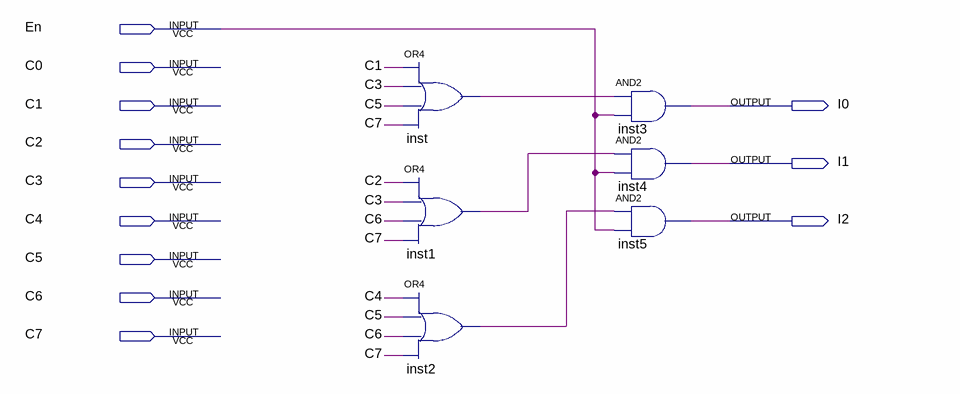
[diagram p0: schematic sheet]
// Quartus schematic CD8.bdf as structural Verilog: 6 symbols, 12 pins
module CD8 (
  input  En,
  input  C0,
  input  C1,
  input  C2,
  input  C3,
  input  C4,
  input  C5,
  input  C6,
  input  C7,
  output I0,
  output I1,
  output I2
);

  wire inst1_out, inst2_out, inst_out;

  or inst (inst_out, C1, C3, C5, C7);
  or inst1 (inst1_out, C2, C3, C6, C7);
  or inst2 (inst2_out, C4, C5, C6, C7);
  and inst3 (I0, inst_out, En);
  and inst4 (I1, inst1_out, En);
  and inst5 (I2, inst2_out, En);
endmodule
